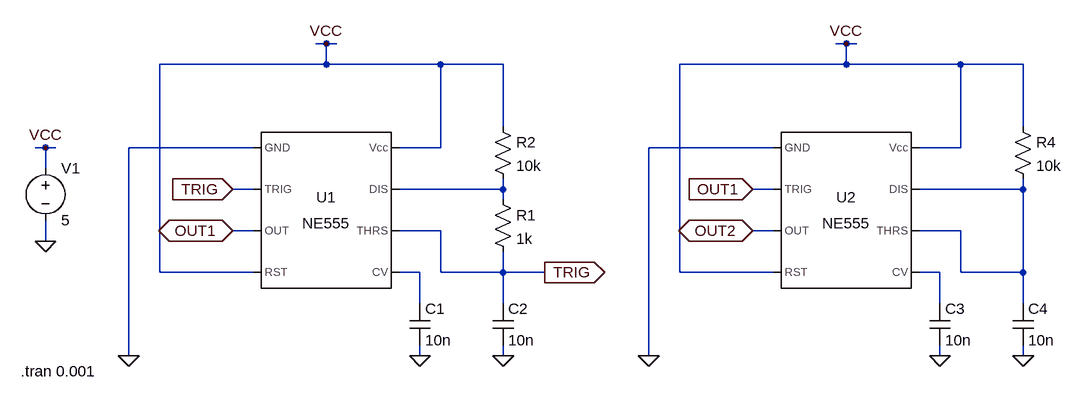
[diagram p0: schematic AtariPunk.asc]
AtariPunk.asc, the LTspice schematic file:
Version 4
SHEET 1 1144 680
WIRE -112 -64 -128 -64
WIRE -96 -64 -112 -64
WIRE 688 -64 672 -64
WIRE 704 -64 688 -64
WIRE -112 -32 -112 -64
WIRE -112 -32 -368 -32
WIRE 64 -32 -112 -32
WIRE 160 -32 64 -32
WIRE 688 -32 688 -64
WIRE 688 -32 432 -32
WIRE 864 -32 688 -32
WIRE 960 -32 864 -32
WIRE 160 64 160 -32
WIRE 960 64 960 -32
WIRE -544 96 -560 96
WIRE -528 96 -544 96
WIRE -224 96 -416 96
WIRE 64 96 64 -32
WIRE 64 96 0 96
WIRE 576 96 384 96
WIRE 864 96 864 -32
WIRE 864 96 800 96
WIRE -544 128 -544 96
WIRE -224 160 -256 160
WIRE 160 160 160 144
WIRE 160 160 0 160
WIRE 576 160 544 160
WIRE 960 160 960 144
WIRE 960 160 800 160
WIRE 160 176 160 160
WIRE -224 224 -256 224
WIRE 64 224 0 224
WIRE 576 224 544 224
WIRE 864 224 800 224
WIRE -544 240 -544 208
WIRE -368 288 -368 -32
WIRE -224 288 -368 288
WIRE 32 288 0 288
WIRE 64 288 64 224
WIRE 160 288 160 256
WIRE 160 288 64 288
WIRE 224 288 160 288
WIRE 432 288 432 -32
WIRE 576 288 432 288
WIRE 832 288 800 288
WIRE 864 288 864 224
WIRE 960 288 960 160
WIRE 960 288 864 288
WIRE 32 336 32 288
WIRE 160 336 160 288
WIRE 832 336 832 288
WIRE 960 336 960 288
WIRE -416 416 -416 96
WIRE 32 416 32 400
WIRE 160 416 160 400
WIRE 384 416 384 96
WIRE 832 416 832 400
WIRE 960 416 960 400
FLAG -544 96 VCC
FLAG -544 240 0
FLAG 32 416 0
FLAG -256 224 OUT1
IOPIN -256 224 BiDir
FLAG -256 160 TRIG
IOPIN -256 160 In
FLAG 160 416 0
FLAG 224 288 TRIG
IOPIN 224 288 Out
FLAG -416 416 0
FLAG -112 -64 VCC
FLAG 832 416 0
FLAG 544 224 OUT2
IOPIN 544 224 BiDir
FLAG 544 160 OUT1
IOPIN 544 160 In
FLAG 960 416 0
FLAG 384 416 0
FLAG 688 -64 VCC
SYMBOL Misc\\NE555 -112 192 R0
SYMATTR InstName U1
SYMBOL voltage -544 112 R0
WINDOW 123 0 0 Left 0
WINDOW 39 0 0 Left 0
SYMATTR InstName V1
SYMATTR Value 5
SYMBOL res 144 160 R0
SYMATTR InstName R1
SYMATTR Value 1k
SYMBOL res 144 48 R0
SYMATTR InstName R2
SYMATTR Value 10k
SYMBOL cap 16 336 R0
SYMATTR InstName C1
SYMATTR Value 10n
SYMBOL cap 144 336 R0
SYMATTR InstName C2
SYMATTR Value 10n
SYMBOL Misc\\NE555 688 192 R0
SYMATTR InstName U2
SYMBOL res 944 48 R0
SYMATTR InstName R4
SYMATTR Value 10k
SYMBOL cap 816 336 R0
SYMATTR InstName C3
SYMATTR Value 10n
SYMBOL cap 944 336 R0
SYMATTR InstName C4
SYMATTR Value 10n
TEXT -582 440 Left 2 !.tran 0.001

The netlist it stands for:
* AtariPunk.asc
XU1 0 TRIG OUT1 VCC N003 TRIG N001 VCC NE555  ; pins GND TRIG OUT RST CV THRS DIS Vcc
V1 VCC 0 5
R1 N001 TRIG 1k
R2 VCC N001 10k
C1 N003 0 10n
C2 TRIG 0 10n
XU2 0 OUT1 OUT2 VCC N004 N002 N002 VCC NE555  ; pins GND TRIG OUT RST CV THRS DIS Vcc
R4 VCC N002 10k
C3 N004 0 10n
C4 N002 0 10n
.tran 0.001
.lib NE555.sub
.backanno
.end